# Altium schematic sheet EPROM_Programmer_2.SchDoc: EPROM MANUAL PROGRAMMER 2
size A4; Author: L.JAOUANNE; Revision: v1.0; SheetNumber: 2; SheetTotal: 3
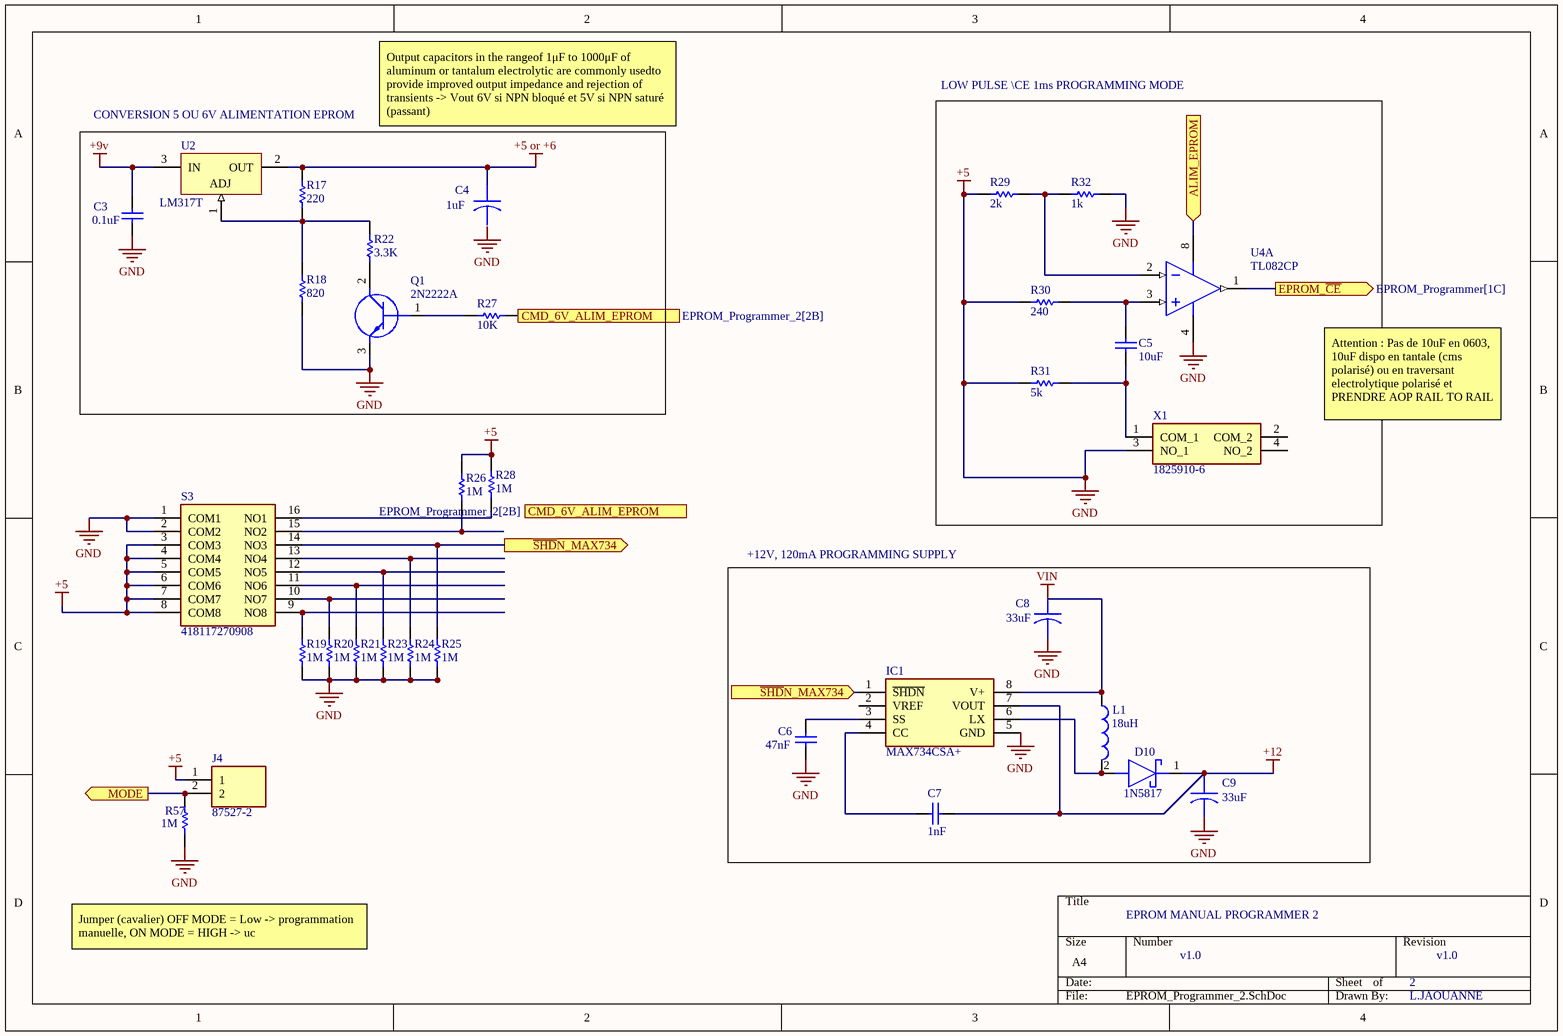
[diagram p0: EPROM_Programmer_2.SchDoc]

## Parts
C3  0.1uF  [C0603]
C4  1uF  [CAPPRD200W50D550H1250]
C5  10uF  [C0603]
C6  47nF  [C0603]
C7  1nF  [C0603]
C8  33uF  [CAPPRD200W50D550H1250]
C9  33uF  [CAPPRD200W50D550H1250]
D10  1N5817  [DIOAD950W60L350D150]
IC1  MAX734CSA+  [SOIC127P600X175-8N]
J4  87527-2  [HDRV2W66P0X254_1X2_467X244X1044P]
L1  value 18uH  [2029]  (hidden comment: Inductor)
Q1  2N2222A  [TO-18_4]
R17  value 220  [R0603]  (hidden comment: Res1)
R18  value 820  [R0603]  (hidden comment: Res1)
R19  value 1M  [R0603]  (hidden comment: Res1)
R20  value 1M  [R0603]  (hidden comment: Res1)
R21  value 1M  [R0603]  (hidden comment: Res1)
R22  value 3.3K  [R0603]  (hidden comment: Res1)
R23  value 1M  [R0603]  (hidden comment: Res1)
R24  value 1M  [R0603]  (hidden comment: Res1)
R25  value 1M  [R0603]  (hidden comment: Res1)
R26  value 1M  [R0603]  (hidden comment: Res1)
R27  value 10K  [R0603]  (hidden comment: Res1)
R28  value 1M  [R0603]  (hidden comment: Res1)
R29  value 2k  [R0603]  (hidden comment: Res1)
R30  value 240  [R0603]  (hidden comment: Res1)
R31  value 5k  [R0603]  (hidden comment: Res1)
R32  value 1k  [R0603]  (hidden comment: Res1)
R57  value 1M  [R0603]  (hidden comment: Res1)
S3  418117270908  [DIPS762W60P254L2132H695Q16N]
U2  LM317T  [TO254P1054X470X1955-3]
U4  TL082CP  [P0008A]  (part A of 2)
X1  1825910-6  [18259106]

## Blocks framed on the sheet
CONVERSION 5 OU 6V ALIMENTATION EPROM: C3 C4 Q1 R17 R18 R22 R27 U2
LOW PULSE \CE 1ms PROGRAMMING MODE: C5 R29-R32 U4 X1
+12V, 120mA PROGRAMMING SUPPLY: C6-C9 D10 IC1 L1

## Ports
ALIM_EPROM (in), CMD_6V_ALIM_EPROM (in, see EPROM_Programmer_2[2B]), CMD_6V_ALIM_EPROM (out, see EPROM_Programmer_2[2B]), EPROM_~{CE} (out, see EPROM_Programmer[1C]), MODE (out), ~{SHD}N_MAX734 (in, see EPROM_Programmer_2[2C]), ~{SHD}N_MAX734 (out, see EPROM_Programmer_2[2C])

## Nets
+5: C3.2 C6.2 C8.2 C9.2 IC1.5(GND) J4.1 Q1.3(E) R18.2 R19.2 R20.2 R21.2 R23.2 R24.2 R25.2 R26.1 R28.1 R29.2 R30.2 R31.2 R32.1 R57.2 S3.1(COM1) S3.2(COM2) S3.3(COM3) S3.4(COM4) S3.5(COM5) S3.6(COM6) S3.7(COM7) S3.8(COM8) U4.4(VCC-) X1.3(NO_1)  [also labelled GND]
+5 or +6: C4.1 R17.2 U2.2(OUT)
+9v: C3.1 U2.3(IN)
+12: C7.2 C9.1 D10.1(K) IC1.7(VOUT)
VIN: C8.1
ALIM_EPROM: U4.8(VCC+) ; port ALIM_EPROM
CMD_6V_ALIM_EPROM: R27.1 ; port CMD_6V_ALIM_EPROM
EPROM_~{CE}: U4.1(OUT1) ; port EPROM_~{CE}
MODE: J4.2 R57.1 ; port MODE
~{SHD}N_MAX734: IC1.1(~{SHDN}) R25.1 S3.14(NO3) ; port ~{SHD}N_MAX734
NetC5_1: C5.1 R30.1 U4.3(IN1+)
NetC5_2: C5.2 R31.1 X1.1(COM_1)
NetC6_1: C6.1 IC1.3(SS)
NetC7_1: C7.1 IC1.4(CC)
NetD10_2: D10.2(A) IC1.6(LX) L1.2
NetIC1_8: IC1.8(V+) L1.1
NetQ1_1: Q1.1(B) R27.2
NetQ1_2: Q1.2(C) R22.2
NetR17_1: R17.1 R18.1 R22.1 U2.1(ADJ)
NetR19_1: R19.1 S3.9(NO8)
NetR20_1: R20.1 S3.10(NO7)
NetR21_1: R21.1 S3.11(NO6)
NetR23_1: R23.1 S3.12(NO5)
NetR24_1: R24.1 S3.13(NO4)
NetR26_2: R26.2 S3.15(NO2)
NetR28_2: R28.2 S3.16(NO1)
NetR29_1: R29.1 R32.2 U4.2(IN1-)

Not connected (* = marked no-connect by the designer): C4 2; IC1 2(VREF); X1 2(COM_2) 4(NO_2)

## Notes on the sheet
- Output capacitors in the rangeof 1μF to 1000μF of aluminum or tantalum electrolytic are commonly usedto provide improved output impedance and rejection of transients -> Vout 6V si NPN bloqué et 5V si NPN saturé (passant)
- Attention : Pas de 10uF en 0603, 10uF dispo en tantale (cms polarisé) ou en traversant electrolytique polarisé et PRENDRE AOP RAIL TO RAIL
- Jumper (cavalier) OFF MODE = Low -> programmation manuelle, ON MODE = HIGH -> uc
- Labels drawn without touching a wire or pin: GND

## Library data of the parts
C3 C5-C7 = Cap: Capacitor; Value: 100pF; PackageReference: RAD-0.3; PackageDescription: Radial Cap, Thru-Hole; 2 Leads; 0.3 in Pin Spacing
C4 C8 C9 = UVR1C330MDD: 33ÂµF 16V Aluminum Electrolytic Capacitors Radial, Can 2000 Hrs @ 85Â°C; MF: Nichicon; Availability: Good; MP: UVR1C330MDD; Package: Radial Nichicon; SnapEDA_Link: https://www.snapeda.com/parts/UVR1C330MDD/Nichicon/view-part/859142/?ref=snap; Purchase-URL: https://pricing.snapeda.com/search/part/UVR1C330MDD/?ref=eda; Check_prices: https://www.snapeda.com/parts/UVR1C330MDD/Nichicon/view-part/859142/?ref=eda; Value: *; Price: None
D10 = SD103A-TR: Schottky Diode; Manufacturer_Name: Vishay; Datasheet Link: https://componentsearchengine.com/Datasheets/5/SD103A-TR.pdf; Manufacturer_Part_Number: SD103A-TR; Mouser Part Number: 625-SD103A; Mouser Price/Stock: https://www.mouser.co.uk/ProductDetail/Vishay-Semiconductors/SD103A-TR?qs=RwahMLkpD2urFD%2FzZdGOBw%3D%3D; Arrow Part Number: SD103A-TR; Arrow Price/Stock: https://www.arrow.com/en/products/sd103a-tr/vishay?region=nac
IC1 = MAX734CSA+: Integrated Circuit; Manufacturer_Name: Analog Devices; Datasheet Link: https://datasheets.maximintegrated.com/en/ds/MAX734.pdf; Height: 1.75mm; Manufacturer_Part_Number: MAX734CSA+; Mouser Part Number: 700-MAX734CSA; Mouser Price/Stock: https://www.mouser.co.uk/ProductDetail/Analog-Devices-Maxim-Integrated/MAX734CSA%2b?qs=1THa7WoU59E%252BWIOpGpIp2A%3D%3D; Arrow Part Number: MAX734CSA+; Arrow Price/Stock: https://www.arrow.com/en/products/max734csa/analog-devices?region=europe
J4 = 87527-2: Connector Embases et logements de câbles HEADER 2 POS; Manufacturer_Name: TE Connectivity; Datasheet Link: https://www.te.com/commerce/DocumentDelivery/DDEController?Action=showdoc&DocId=Customer+Drawing%7F87527%7FH%7Fpdf%7FEnglish%7FENG_CD_87527_H.pdf%7F87527-2; Height: 10.439mm; Manufacturer_Part_Number: 87527-2; Mouser Part Number: 571-875272; Mouser Price/Stock: https://www.mouser.co.uk/ProductDetail/TE-Connectivity/87527-2?qs=ZDXmSm13593hsB4j%252B6gMfg%3D%3D; Arrow Part Number: 87527-2; Arrow Price/Stock: https://www.arrow.com/en/products/87527-2/te-connectivity?region=nac
Q1 = 2N2222A: Transistor BJT NPN; Manufacturer_Name: STMicroelectronics; Datasheet Link: https://datasheet.datasheetarchive.com/originals/distributors/Datasheets-25/DSA-481035.pdf; Manufacturer_Part_Number: 2N2222A; Mouser Part Number: 511-2N2222A; Mouser Price/Stock: https://www.mouser.co.uk/ProductDetail/STMicroelectronics/2N2222A?qs=UMEuL5FsraBzcgM1cdcH3A%3D%3D
R17-R32 R57 = Res1: Resistor; PackageReference: AXIAL-0.3; PackageDescription: Axial Device, Thru-Hole; 2 Leads; 0.3 in Pin Spacing
S3 = 418117270908: Switch; Manufacturer_Name: Wurth Elektronik; Datasheet Link: https://www.we-online.com/catalog/datasheet/418117270908.pdf; Height: 6.95mm; Manufacturer_Part_Number: 418117270908; Mouser Part Number: 710-418117270908; Mouser Price/Stock: https://www.mouser.co.uk/ProductDetail/Wurth-Elektronik/418117270908?qs=wr8lucFkNMXJyYOZ9v4znw%3D%3D
U2 = CMP-0244-00444-1: 1.5A, 1.2V to 37V Adjustable Voltage Regulator, 3-Pin TO-220; PackageVersion: 2011; ComponentLink1URL: http://www.st.com; ComponentLink2URL: http://www.st.com/internet/com/TECHNICAL_RESOURCES/TECHNICAL_LITERATURE/DATASHEET/CD00000455.pdf; PackageDescription: TO, Thru-Hole, Vertical, Heatsink Mounted; 3 In-Line Leads; Pitch 2.54 mm; PackageReference: TO-220; ComponentLink1Description: Manufacturer URL; ComponentLink3URL: http://www.st.com/internet/com/TECHNICAL_RESOURCES/TECHNICAL_LITERATURE/PACKAGE_INFORMATION/CD00004649.pdf; DatasheetVersion: 1/11/2011; ComponentLink2Description: Datasheet; ComponentLink3Description: Package Specification
U4 = CMP-0055-00158-5: JFET-Input Operational Amplifier, 7 to 36 V, 0 to 70 degC, 8-pin DIP (P8), Pb-Free (RoHS); Manufacturer: Texas Instruments; Total Supply Voltage(Max)(+5V is 5, +/-5V is 10): 36; Rating: Catalog; Number of Channels: 2; Slew Rate(Typ)(V/us): 13; CMRR(Min)(dB): 70; Sub Family: General Purpose Amplifier, High Supply Voltage Amplifier (>=30V); Offset Drift(Typ)(uV/C): 18; Total Supply Voltage(Min)(+5V is 5, +/-5V is 10): 7; IIB(Max)(pA): 400; GBW(Typ)(MHz): 3; Iq per channel(Max)(mA): 2.8; Vio (25C)(Max)(mV): 15; PackageDescription: 8-Pin Plastic In-Line, Body 9.59 x 6.35 mm, Pitch 2.54 mm; ComponentLink2URL: http://www.ti.com/lit/ds/symlink/tl082.pdf; Mounting Technology: Through Hole; Code_JEDEC: MS-001; ComponentLink1Description: Manufacturer URL; ComponentLink3Description: Package Specification; PartNumber: TL082CP; PackageVersion: 4040082/E, 04/2010; Eco-Plan: Pb-Free (RoHS); ComponentLink1URL: http://www.ti.com/; PackageReference: P0008A; ComponentLink3URL: http://www.ti.com/litv/pdf/mpdi001b; DatasheetVersion: SLOS081G; ComponentLink2Description: Datasheet; Vn at 1kHz(Typ)(nV/rtHz): 18
X1 = 1825910-6: Body Features: Product Orientation Vertical; Manufacturer_Name: TE Connectivity; Geometry.Height: 5.3mm; Manufacturer_Part_Number: 1825910-6; Mouser Part Number: 650-1825910-6; Mouser Price/Stock: https://www.mouser.co.uk/ProductDetail/TE-Connectivity/1825910-6?qs=A6cQTCBcXncisYDS1KbpGA%3D%3D; Arrow Part Number: 1825910-6; Arrow Price/Stock: https://www.arrow.com/en/products/1825910-6/te-connectivity?region=nac; Datasheet Link: https://www.te.com/commerce/DocumentDelivery/DDEController?Action=srchrtrv&DocNm=1308111-1_SWITCHES_CORE_PROGRAM_CATALOG&DocType=Catalog%20Section&DocLang=English&PartCntxt=1825910-6&DocFormat=pdf
L1 = Inductor: PackageReference: 0402-A; PackageDescription: Chip Inductor